# Altium schematic sheet [16]-CLOCK.SchDoc
size A4
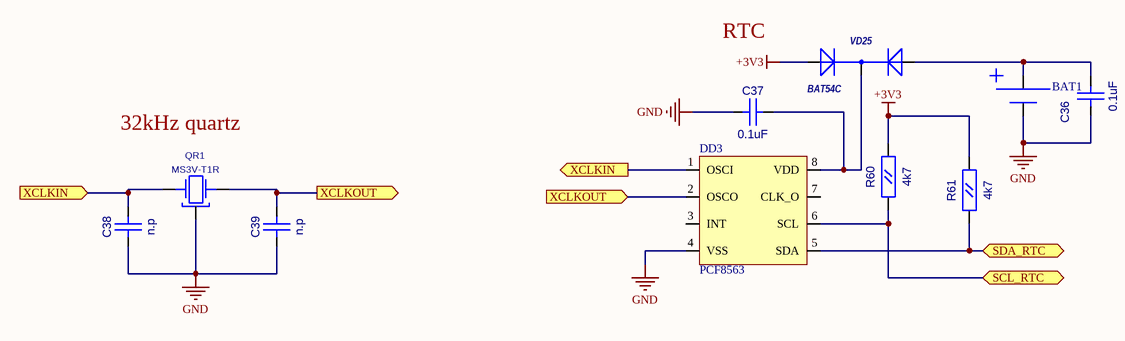
[diagram p0: [16]-CLOCK.SchDoc]

## Parts
BAT1  CR2032-VBY4  [CR2032_ONBOARD]  (value not drawn)
C36  0.1uF  [CC0603]
C37  0.1uF  [CC0603]
C38  n.p  [CC0603]
C39  n.p  [CC0603]
DD3  PCF8563  [SO-8]
QR1  MS3V-T1R  [MS3V-T1R]
R60  4k7  [RC0603]
R61  4k7  [RC0603]
VD25  BAT54C  [SOT-23(123)]

## Ports
SCL_RTC (bidir), SDA_RTC (bidir), XCLKIN (in), XCLKIN (out), XCLKOUT (in), XCLKOUT (out)

## Nets
+3V3: R60.2(B) R61.2(B) VD25.1(A)
GND: BAT1.1 C36.1(A) C37.1(A) C38.1(A) C39.1(A) DD3.4(VSS) QR1.3
SCL_RTC: DD3.6(SCL) R60.1(A) ; port SCL_RTC
SDA_RTC: DD3.5(SDA) R61.1(A) ; port SDA_RTC
XCLKIN: C38.2(B) DD3.1(OSCI) QR1.2(X2) ; port XCLKIN
XCLKOUT: C39.2(B) DD3.2(OSCO) QR1.1(X1) ; port XCLKOUT
NetBAT1_2: BAT1.2 C36.2(B) VD25.2(A)
NetC37_2: C37.2(B) DD3.8(VDD) VD25.3(K)

Not connected (* = marked no-connect by the designer): DD3 3(INT) 7(CLK_O)

## Notes on the sheet
- RTC
- 32kHz quartz

## Library data of the parts
BAT1 = CR2032-VBY2: Value: CR2032-VBY4
C36-C39 = CC0603
  C36 C37: Value: 0.1uF
  C38 C39: Value: n.p
QR1 = MS3V-T1R: CRYSTAL_32768 Hz; Value: MS3V-T1R
R60 R61 = RC0603: Value: 4k7
DD3 = PCF8563: Value: PCF8563
VD25 = BAT54C: Value: *